# Altium schematic sheet UBC-Thunderbots_PCB_Power__power-v3.1_pcb__power-v3.1.SchDoc
size A4; SheetNumber: 1
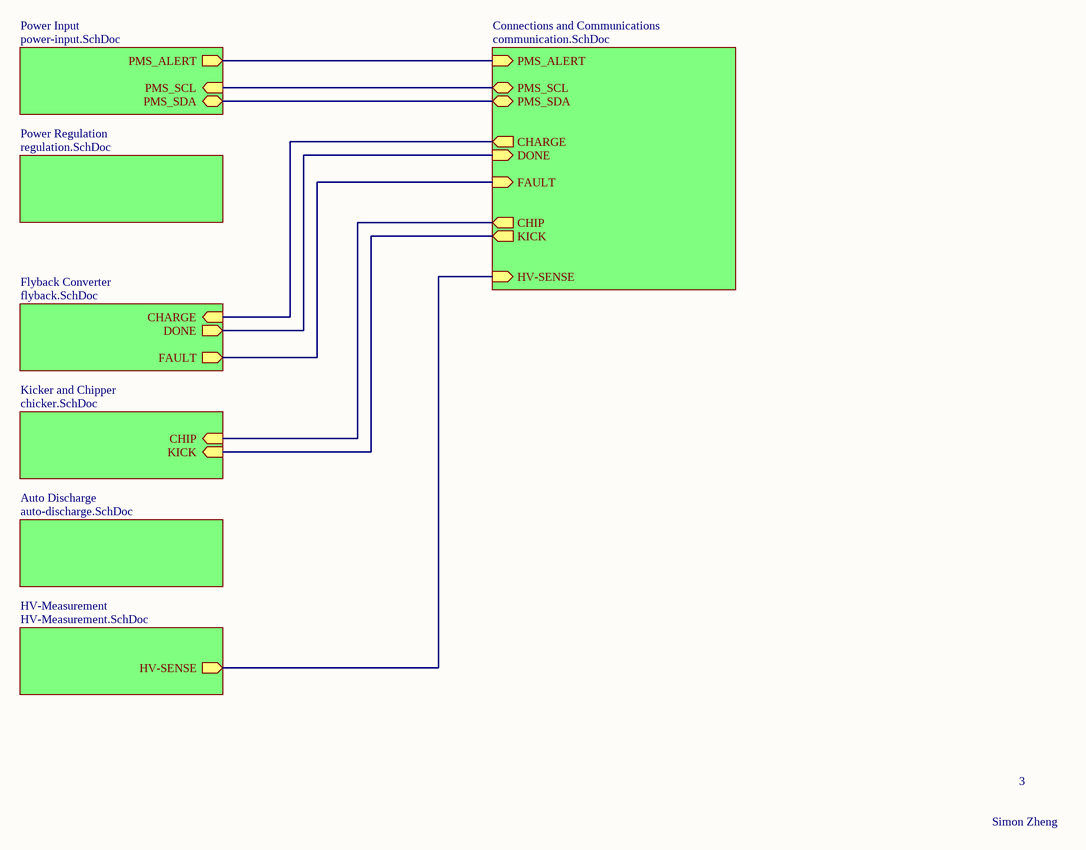
[diagram p0: UBC-Thunderbots_PCB_Power__power-v3.1_pcb__power-v3.1.SchDoc]

## Sub-sheets
Auto Discharge = auto-discharge.SchDoc: no entries
Connections and Communications = communication.SchDoc: PMS_SCL (bidir), PMS_SDA (bidir), DONE (in), CHARGE (out), PMS_ALERT (in), FAULT (in), KICK (out), HV-SENSE (in), CHIP (out)
Flyback Converter = flyback.SchDoc: FAULT (out), DONE (out), CHARGE (in)
HV-Measurement = HV-Measurement.SchDoc: HV-SENSE (out)
Kicker and Chipper = chicker.SchDoc: CHIP (in), KICK (in)
Power Input = power-input.SchDoc: PMS_SDA (bidir), PMS_SCL (in), PMS_ALERT (out)
Power Regulation = regulation.SchDoc: no entries

## Nets
(unnamed): sheet Flyback Converter/FAULT, sheet Connections and Communications/FAULT
(unnamed): sheet Flyback Converter/DONE, sheet Connections and Communications/DONE
(unnamed): sheet Flyback Converter/CHARGE, sheet Connections and Communications/CHARGE
(unnamed): sheet Kicker and Chipper/CHIP, sheet Connections and Communications/CHIP
(unnamed): sheet Kicker and Chipper/KICK, sheet Connections and Communications/KICK
(unnamed): sheet Power Input/PMS_SDA, sheet Connections and Communications/PMS_SDA
(unnamed): sheet Power Input/PMS_SCL, sheet Connections and Communications/PMS_SCL
(unnamed): sheet Power Input/PMS_ALERT, sheet Connections and Communications/PMS_ALERT
(unnamed): sheet Connections and Communications/HV-SENSE, sheet HV-Measurement/HV-SENSE

## Notes on the sheet
- 3
- Simon Zheng